# Altium project copper_suicide.PrjPCB (part 2 of 2)

## Sheet config-bank8.SchDoc: Config FPGA - Bank 8
size Letter; CompanyName: Brinton Engineering, LLC; Address1: 3479 Edison Way; Address2: Menlo Park CA 94025; Address3: +1 (877) 778-8435; Address4: brintonengineering.com; Revision: 1; SheetNumber: 1; SheetTotal: 1
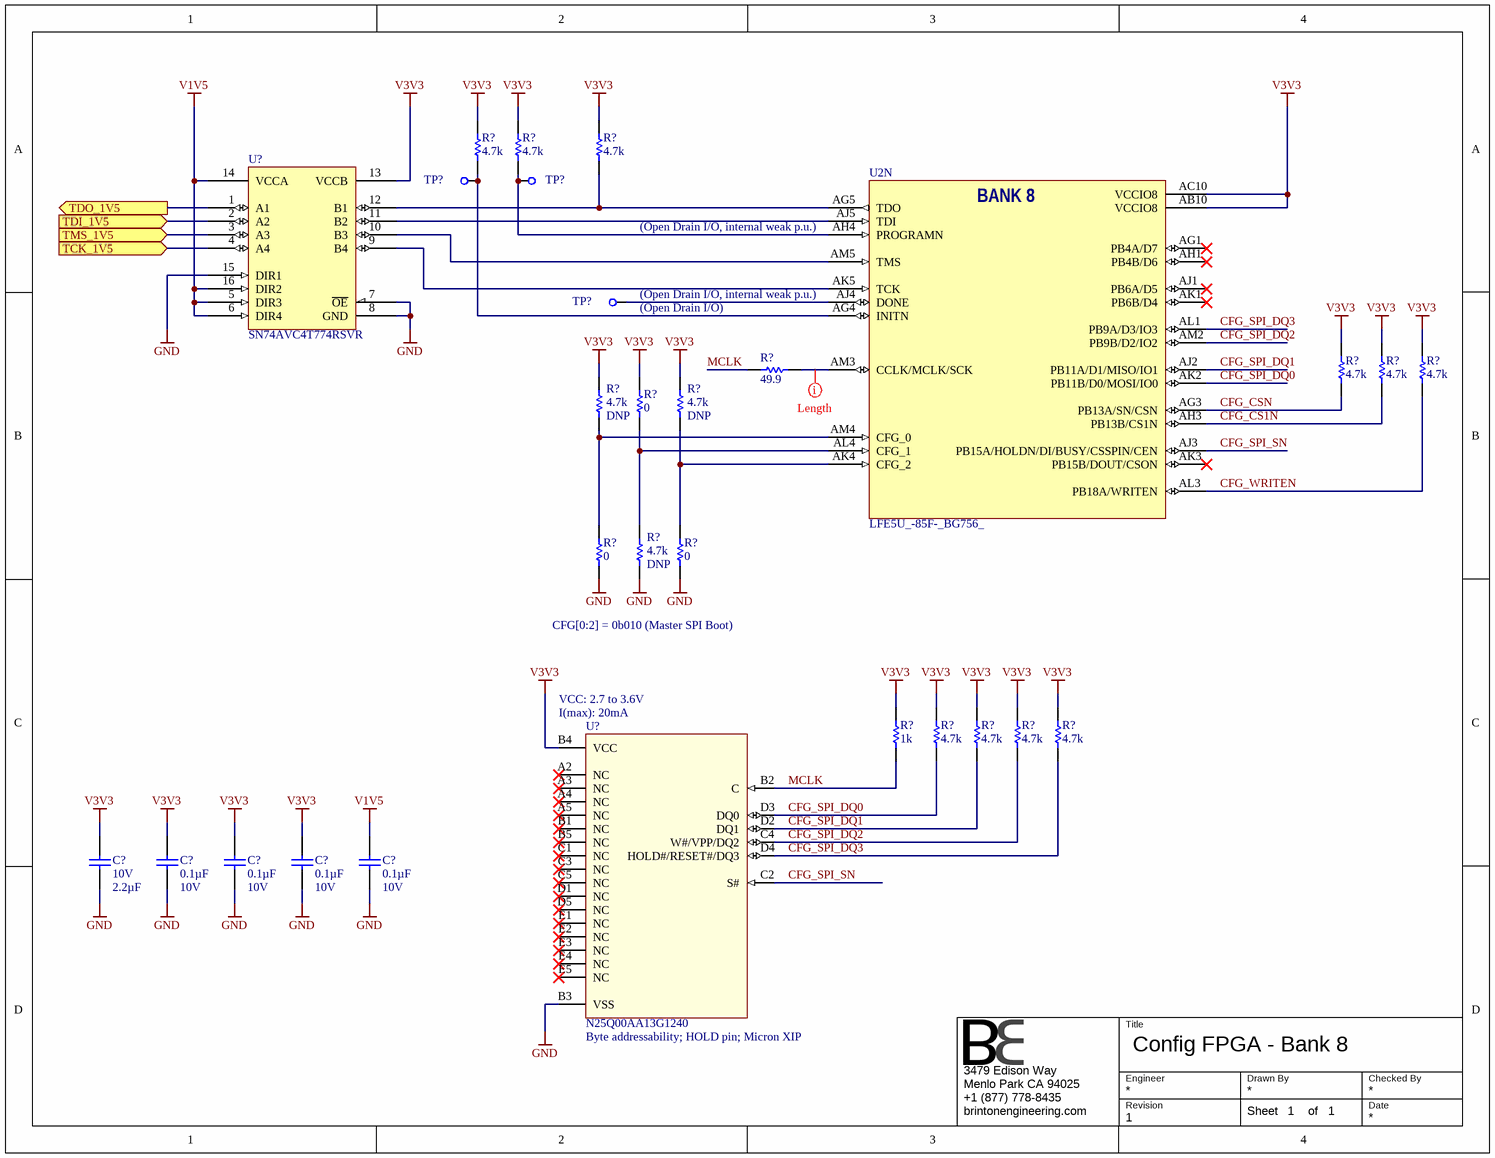
[diagram p16: config-bank8.SchDoc]

### Parts
(Parts that share a designator on the sheet are numbered #1, #2 ... from top to bottom, then left to right.)
C?#36  Voltage - Rated: 10V  Capacitance: 2.2µF  [CAPC1608X90N]  (hidden comment: GRM188R71A225KE15D)
C?#37  Capacitance: 0.1µF  Voltage - Rated: 10V  [CAPC1005X56N]  (hidden comment: GRM155R71A104KA01J)
C?#38  Capacitance: 0.1µF  Voltage - Rated: 10V  [CAPC1005X56N]  (hidden comment: GRM155R71A104KA01J)
C?#39  Capacitance: 0.1µF  Voltage - Rated: 10V  [CAPC1005X56N]  (hidden comment: GRM155R71A104KA01J)
C?#40  Capacitance: 0.1µF  Voltage - Rated: 10V  [CAPC1005X56N]  (hidden comment: GRM155R71A104KA01J)
R?#17  value 4.7k  [0603]  (hidden comment: RES 0603 4.7k 1%)
R?#18  value 4.7k  [0603]  (hidden comment: RES 0603 4.7k 1%)
R?#19  value 4.7k  [0603]  (hidden comment: RES 0603 4.7k 1%)
R?#20  value 49.9  [0603]  (hidden comment: RES 0603 49.9 1%)
R?#21  value 4.7k  [0603]  (hidden comment: RES 0603 4.7k 1%)
R?#22  value 4.7k  [0603]  (hidden comment: RES 0603 4.7k 1%)
R?#23  value 4.7k  [0603]  (hidden comment: RES 0603 4.7k 1%)
R?#24  value 4.7k  Do Not Place: DNP  [0603]  (hidden comment: RES 0603 4.7k 1%)
R?#25  value 0  [0603]  (hidden comment: RES 0603 0)
R?#26  value 4.7k  Do Not Place: DNP  [0603]  (hidden comment: RES 0603 4.7k 1%)
R?#27  value 0  [0603]  (hidden comment: RES 0603 0)
R?#28  value 4.7k  Do Not Place: DNP  [0603]  (hidden comment: RES 0603 4.7k 1%)
R?#29  value 0  [0603]  (hidden comment: RES 0603 0)
R?#30  value 1k  [0603]  (hidden comment: RES 0603 1k 1%)
R?#31  value 4.7k  [0603]  (hidden comment: RES 0603 4.7k 1%)
R?#32  value 4.7k  [0603]  (hidden comment: RES 0603 4.7k 1%)
R?#33  value 4.7k  [0603]  (hidden comment: RES 0603 4.7k 1%)
R?#34  value 4.7k  [0603]  (hidden comment: RES 0603 4.7k 1%)
TP?#2  TEST_POINT_SMD_10  [TEST_POINT_SMD_10]  (value not drawn)  (no BOM)
TP?#3  TEST_POINT_SMD_10  [TEST_POINT_SMD_10]  (value not drawn)  (no BOM)
TP?#4  TEST_POINT_SMD_10  [TEST_POINT_SMD_10]  (value not drawn)  (no BOM)
U2  LFE5U_-85F-_BG756_  [caBGA756]  (part N of 19)
U?#2  SN74AVC4T774RSVR  [RSV]
U?#3  N25Q00AA13G1240  [L-PBGA-24]

### Ports
TCK_1V5 (in), TDI_1V5 (in), TDO_1V5 (out), TMS_1V5 (in)

### Nets
GND: C?#36.1 C?#37.1 C?#38.1 C?#39.1 C?#40.1 R?#27.1 R?#28.1 R?#29.1 U?#2.7(~{OE}) U?#2.8(GND) U?#2.15(DIR1) U?#3.B3(VSS)
V1V5: C?#40.2 U?#2.5(DIR3) U?#2.6(DIR4) U?#2.14(VCCA) U?#2.16(DIR2)
V3V3: C?#36.2 C?#37.2 C?#38.2 C?#39.2 R?#17.2 R?#18.2 R?#19.2 R?#21.2 R?#22.2 R?#23.2 R?#24.2 R?#25.2 R?#26.2 R?#30.2 R?#31.2 R?#32.2 R?#33.2 R?#34.2 U2.AB10(VCCIO8) U2.AC10(VCCIO8) U?#2.13(VCCB) U?#3.B4(VCC)
CFG_CS1N: R?#22.1 U2.AH3(PB13B/CS1N)
CFG_CSN: R?#21.1 U2.AG3(PB13A/SN/CSN)
CFG_SPI_DQ0: R?#31.1 U2.AK2(PB11B/D0/MOSI/IO0) U?#3.D3(DQ0)
CFG_SPI_DQ1: R?#32.1 U2.AJ2(PB11A/D1/MISO/IO1) U?#3.D2(DQ1)
CFG_SPI_DQ2: R?#33.1 U2.AM2(PB9B/D2/IO2) U?#3.C4(W#/VPP/DQ2)
CFG_SPI_DQ3: R?#34.1 U2.AL1(PB9A/D3/IO3) U?#3.D4(HOLD#/RESET#/DQ3)
CFG_SPI_SN: U2.AJ3(PB15A/HOLDN/DI/BUSY/CSSPIN/CEN) U?#3.C2(S#)
CFG_WRITEN: R?#23.1 U2.AL3(PB18A/WRITEN)
MCLK: R?#20.2 R?#30.1 U?#3.B2(C)
NetR?#17_1: R?#17.1 TP?#2.1 U2.AG4(INITN)
NetR?#18_1: R?#18.1 TP?#3.1 U2.AH4(PROGRAMN)
NetR?#19_1: R?#19.1 U2.AG5(TDO) U?#2.12(B1)
NetR?#20_1: R?#20.1 U2.AM3(CCLK/MCLK/SCK)
NetR?#24_1: R?#24.1 R?#27.2 U2.AM4(CFG_0)
NetR?#25_1: R?#25.1 R?#28.2 U2.AL4(CFG_1)
NetR?#26_1: R?#26.1 R?#29.2 U2.AK4(CFG_2)
NetTP?#4_1: TP?#4.1 U2.AJ4(DONE)
NetU2_AJ5: U2.AJ5(TDI) U?#2.11(B2)
NetU2_AK5: U2.AK5(TCK) U?#2.9(B4)
NetU2_AM5: U2.AM5(TMS) U?#2.10(B3)
NetU?#2_1: U?#2.1(A1) ; port TDO_1V5
NetU?#2_2: U?#2.2(A2) ; port TDI_1V5
NetU?#2_3: U?#2.3(A3) ; port TMS_1V5
NetU?#2_4: U?#2.4(A4) ; port TCK_1V5

Not connected (* = marked no-connect by the designer): U2 AG1(PB4A/D7)* AH1(PB4B/D6)* AJ1(PB6A/D5)* AK1(PB6B/D4)* AK3(PB15B/DOUT/CSON)*; U?#3 A2(NC)* A3(NC)* A4(NC)* A5(NC)* B1(NC)* B5(NC)* C1(NC)* C3(NC)* C5(NC)* D1(NC)* D5(NC)* E1(NC)* E2(NC)* E3(NC)* E4(NC)* E5(NC)*

### Layout directives
rule Length Constraint [Min Length = 0mil    Max Length = 2000mil]: NetR?#20_1

### Notes on the sheet
- (near U2) (Open Drain I/O, internal weak p.u.)
- (near TP?#4) (Open Drain I/O)
- CFG[0:2] = 0b010 (Master SPI Boot)
- (near U?#3) VCC: 2.7 to 3.6V
- (near U?#3) I(max): 20mA
- (near U?#3) Byte addressability; HOLD pin; Micron XIP
- Title
- Engineer
- Revision
- Drawn By
- Checked By
- Date
- Sheet
- of
- (in symbol LFE5U_-85F-_BG756_, part N) BANK 8

### Library data of the parts
C?#36 = GRM188R71A225KE15D: CAP CER 2.2UF 10V 10% X7R 0603; Manufacturer: Murata Electronics North America; Manufacturer P/N: GRM188R71A225KE15D; Operating Temperature: -55°C ~ 125°C; Thickness (Max): 0.035" (0.90mm); Tolerance: ±10%; Package / Case: 0603 (1608 Metric); Temperature Coefficient: X7R; Supplier 1: Newark; Supplier 2: Digi-Key; RoHS: RoHS Compliant; Size / Dimension: 0.063" L x 0.031" W (1.60mm x 0.80mm); Mounting Type: Surface Mount, MLCC; ComponentLink1URL: http://www.murata.com/~/media/webrenewal/support/library/catalog/products/capacitor/mlcc/c02e.ashx; ComponentLink1Description: http://www.murata.com/~/media/webrenewal/support/library/catalog/products/capacitor/mlcc/c02e.ashx; Supplier Part Number 1: 72R4209; Supplier Part Number 2: 490-4520-1-ND
C?#37-C?#40 = GRM155R71A104KA01J: CAP CER 0.1UF 10V 10% X7R 0402; Manufacturer: Murata Electronics North America; Manufacturer P/N: GRM155R71A104KA01J; Operating Temperature: -55°C ~ 125°C; Thickness (Max): 0.022" (0.55mm); Size / Dimension: 0.039" L x 0.020" W (1.00mm x 0.50mm); RoHS: RoHS Compliant; Mounting Type: Surface Mount, MLCC; Supplier 1: Digi-Key; ComponentLink1URL: http://www.murata.com/~/media/webrenewal/support/library/catalog/products/capacitor/mlcc/c02e.ashx; ComponentLink1Description: http://www.murata.com/~/media/webrenewal/support/library/catalog/products/capacitor/mlcc/c02e.ashx; Supplier Part Number 1: 490-6322-1-ND; Temperature Coefficient: X7R; Package / Case: 0402 (1005 Metric); Tolerance: ±10%
R?#17-R?#19 R?#21-R?#24 R?#26 R?#28 R?#31-R?#34 = RES 0603 10k 1%: Thick Film Resistor 4.7k Ohms +/-1% 0.1W 75V SMD 0603; Manufacturer: Panasonic - ECG; Manufacturer P/N: ERJ3EKF4701V; Tcr: +/-100; Tr: -55:+155; Tolerance: +/-1%; Alternatives: *; Voltage: 75V; Power: 0.1W; P/N: ERJ3EKF4701V
R?#20 = RES 0603 10k 1%: Thick Film Resistor 49.9 Ohms +/-1% 0.1W 75V SMD 0603; Manufacturer: Panasonic - ECG; Manufacturer P/N: ERJ-3EKF49R9V; Tcr: +/-100; Tr: -55:+155; Tolerance: +/-1%; Alternatives: *; Voltage: 75V; Power: 0.1W; P/N: ERJ-3EKF49R9V
R?#25 R?#27 R?#29 = RES 0603 10k 1%: Thick Film Resistor 0 Ohms SMD 0603; Manufacturer: Panasonic - ECG; Manufacturer P/N: ERJ-3GEY0R00V; Tcr: +/-100; Tolerance: +/-1%; Tr: -55:+155; Voltage: 75V; Power: 0.1W; Alternatives: *; P/N: ERJ-3GEY0R00V
R?#30 = RES 0603 10k 1%: Thick Film Resistor 1k Ohms +/-1% 0.1W 75V SMD 0603; Manufacturer: Panasonic - ECG; Manufacturer P/N: ERJ3EKF1001V; Tcr: +/-100; Tr: -55:+155; Tolerance: +/-1%; Alternatives: *; Voltage: 75V; Power: 0.1W; P/N: ERJ3EKF1001V
TP?#2-TP?#4 = TEST_POINT_SMD_10: Test Point SMD
U2 = LFE5U_-85F-_BG756_: as U1 on sheet fpga-bank6; Manufacturer P/N: LFE5U_-85F-_BG756_
U?#2 = SN74AVC4T774RSVR: 4-Bit Dual-Supply Bus Transceiver; Manufacturer: Texas Instruments; Manufacturer P/N: SN74AVC4T774RSVR
U?#3 = N25Q00AA13G1240: 1024Mb, 3.3V Serial Flash Memory LBGA24; Manufacturer: Micron; Manufacturer P/N: N25Q00AA13G1240; Temperature: -40:85

## Sheet config-misc.SchDoc: Config FPGA - Misc
size Letter; CompanyName: Brinton Engineering, LLC; DrawnBy: FPGA - Misc; Address1: 3479 Edison Way; Address2: Menlo Park CA 94025; Address3: +1 (877) 778-8435; Address4: brintonengineering.com; Revision: 1; SheetNumber: 1; SheetTotal: 1
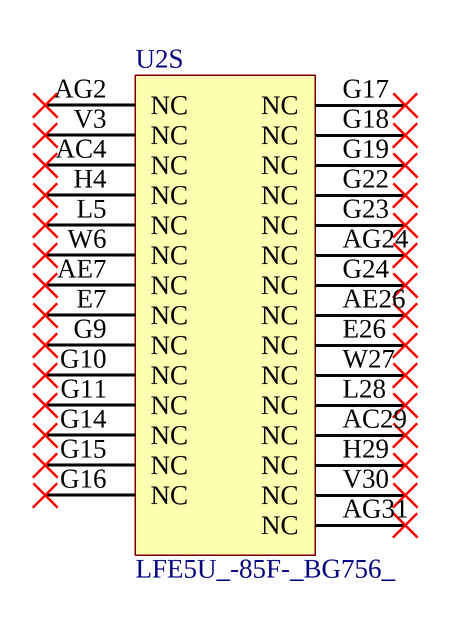
[diagram p17: config-misc.SchDoc]

### Parts
U2  LFE5U_-85F-_BG756_  [caBGA756]  (part S of 19)

### Nets

Not connected (* = marked no-connect by the designer): U2 AC4(NC)* AC29(NC)* AE7(NC)* AE26(NC)* AG2(NC)* AG24(NC)* AG31(NC)* E7(NC)* E26(NC)* G9(NC)* G10(NC)* G11(NC)* G14(NC)* G15(NC)* G16(NC)* G17(NC)* G18(NC)* G19(NC)* G22(NC)* G23(NC)* G24(NC)* H4(NC)* H29(NC)* L5(NC)* L28(NC)* V3(NC)* V30(NC)* W6(NC)* W27(NC)*

### Notes on the sheet
- Title
- Engineer
- Revision
- Drawn By
- Checked By
- Date
- Sheet
- of

### Library data of the parts
U2 = LFE5U_-85F-_BG756_: as U1 on sheet fpga-bank6; Manufacturer P/N: LFE5U_-85F-_BG756_

## Sheet config-ground.SchDoc: Config FPGA - Ground
size Letter; CompanyName: Brinton Engineering, LLC; Address1: 3479 Edison Way; Address2: Menlo Park CA 94025; Address3: +1 (877) 778-8435; Address4: brintonengineering.com; Revision: 1; SheetNumber: 1; SheetTotal: 1
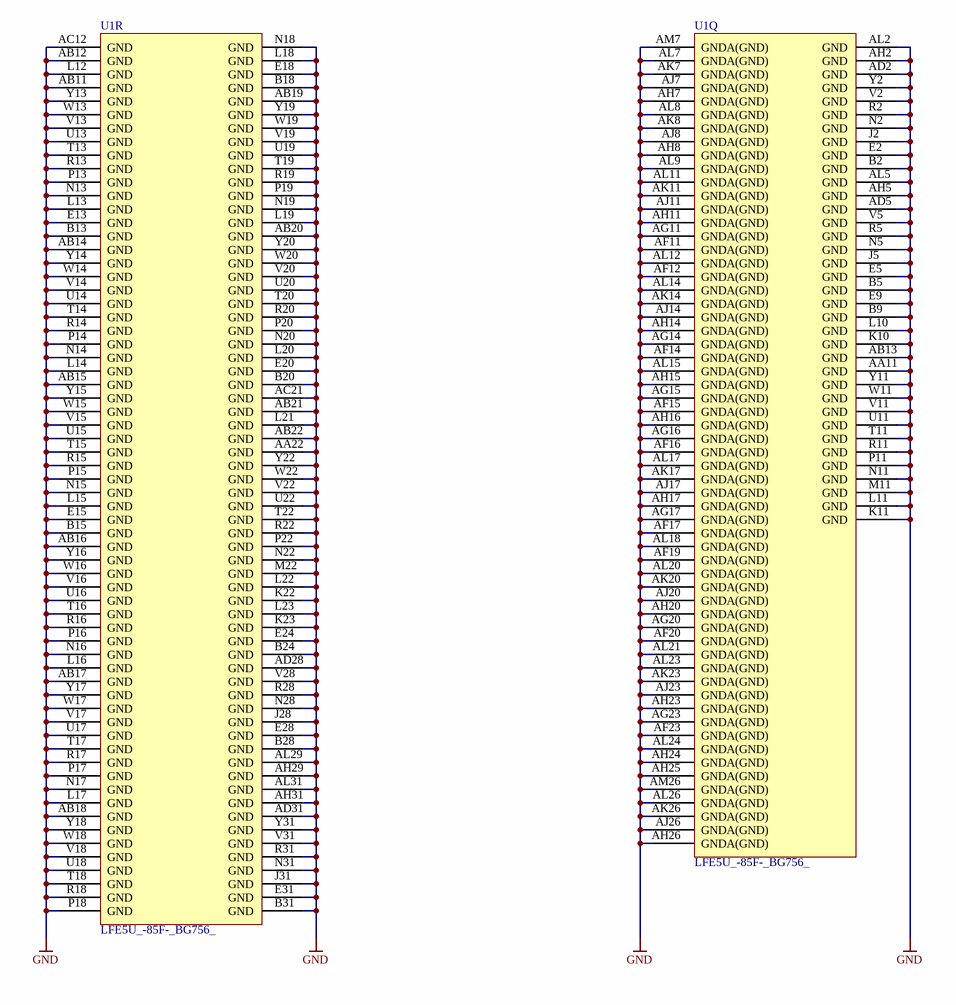
[diagram p18: config-ground.SchDoc]

### Parts
U1  LFE5U_-85F-_BG756_  [caBGA756]  (parts Q,R of 19)

### Nets
GND: U1.AA11(GND) U1.AA22(GND) U1.AB11(GND) U1.AB12(GND) U1.AB13(GND) U1.AB14(GND) U1.AB15(GND) U1.AB16(GND) U1.AB17(GND) U1.AB18(GND) U1.AB19(GND) U1.AB20(GND) U1.AB21(GND) U1.AB22(GND) U1.AC12(GND) U1.AC21(GND) U1.AD2(GND) U1.AD5(GND) U1.AD28(GND) U1.AD31(GND) U1.AF11(GNDA(GND)) U1.AF12(GNDA(GND)) U1.AF14(GNDA(GND)) U1.AF15(GNDA(GND)) U1.AF16(GNDA(GND)) U1.AF17(GNDA(GND)) U1.AF19(GNDA(GND)) U1.AF20(GNDA(GND)) U1.AF23(GNDA(GND)) U1.AG11(GNDA(GND)) U1.AG14(GNDA(GND)) U1.AG15(GNDA(GND)) U1.AG16(GNDA(GND)) U1.AG17(GNDA(GND)) U1.AG20(GNDA(GND)) U1.AG23(GNDA(GND)) U1.AH2(GND) U1.AH5(GND) U1.AH7(GNDA(GND)) U1.AH8(GNDA(GND)) U1.AH11(GNDA(GND)) U1.AH14(GNDA(GND)) U1.AH15(GNDA(GND)) U1.AH16(GNDA(GND)) U1.AH17(GNDA(GND)) U1.AH20(GNDA(GND)) U1.AH23(GNDA(GND)) U1.AH24(GNDA(GND)) U1.AH25(GNDA(GND)) U1.AH26(GNDA(GND)) U1.AH29(GND) U1.AH31(GND) U1.AJ7(GNDA(GND)) U1.AJ8(GNDA(GND)) U1.AJ11(GNDA(GND)) U1.AJ14(GNDA(GND)) U1.AJ17(GNDA(GND)) U1.AJ20(GNDA(GND)) U1.AJ23(GNDA(GND)) U1.AJ26(GNDA(GND)) U1.AK7(GNDA(GND)) U1.AK8(GNDA(GND)) U1.AK11(GNDA(GND)) U1.AK14(GNDA(GND)) U1.AK17(GNDA(GND)) U1.AK20(GNDA(GND)) U1.AK23(GNDA(GND)) U1.AK26(GNDA(GND)) U1.AL2(GND) U1.AL5(GND) U1.AL7(GNDA(GND)) U1.AL8(GNDA(GND)) U1.AL9(GNDA(GND)) U1.AL11(GNDA(GND)) U1.AL12(GNDA(GND)) U1.AL14(GNDA(GND)) U1.AL15(GNDA(GND)) U1.AL17(GNDA(GND)) U1.AL18(GNDA(GND)) U1.AL20(GNDA(GND)) U1.AL21(GNDA(GND)) U1.AL23(GNDA(GND)) U1.AL24(GNDA(GND)) U1.AL26(GNDA(GND)) U1.AL29(GND) U1.AL31(GND) U1.AM7(GNDA(GND)) U1.AM26(GNDA(GND)) U1.B2(GND) U1.B5(GND) U1.B9(GND) U1.B13(GND) U1.B15(GND) U1.B18(GND) U1.B20(GND) U1.B24(GND) U1.B28(GND) U1.B31(GND) U1.E2(GND) U1.E5(GND) U1.E9(GND) U1.E13(GND) U1.E15(GND) U1.E18(GND) U1.E20(GND) U1.E24(GND) U1.E28(GND) U1.E31(GND) U1.J2(GND) U1.J5(GND) U1.J28(GND) U1.J31(GND) U1.K10(GND) U1.K11(GND) U1.K22(GND) U1.K23(GND) U1.L10(GND) U1.L11(GND) U1.L12(GND) U1.L13(GND) U1.L14(GND) U1.L15(GND) U1.L16(GND) U1.L17(GND) U1.L18(GND) U1.L19(GND) U1.L20(GND) U1.L21(GND) U1.L22(GND) U1.L23(GND) U1.M11(GND) U1.M22(GND) U1.N2(GND) U1.N5(GND) U1.N11(GND) U1.N13(GND) U1.N14(GND) U1.N15(GND) U1.N16(GND) U1.N17(GND) U1.N18(GND) U1.N19(GND) U1.N20(GND) U1.N22(GND) U1.N28(GND) U1.N31(GND) U1.P11(GND) U1.P13(GND) U1.P14(GND) U1.P15(GND) U1.P16(GND) U1.P17(GND) U1.P18(GND) U1.P19(GND) U1.P20(GND) U1.P22(GND) U1.R2(GND) U1.R5(GND) U1.R11(GND) U1.R13(GND) U1.R14(GND) U1.R15(GND) U1.R16(GND) U1.R17(GND) U1.R18(GND) U1.R19(GND) U1.R20(GND) U1.R22(GND) U1.R28(GND) U1.R31(GND) U1.T11(GND) U1.T13(GND) U1.T14(GND) U1.T15(GND) U1.T16(GND) U1.T17(GND) U1.T18(GND) U1.T19(GND) U1.T20(GND) U1.T22(GND) U1.U11(GND) U1.U13(GND) U1.U14(GND) U1.U15(GND) U1.U16(GND) U1.U17(GND) U1.U18(GND) U1.U19(GND) U1.U20(GND) U1.U22(GND) U1.V2(GND) U1.V5(GND) U1.V11(GND) U1.V13(GND) U1.V14(GND) U1.V15(GND) U1.V16(GND) U1.V17(GND) U1.V18(GND) U1.V19(GND) U1.V20(GND) U1.V22(GND) U1.V28(GND) U1.V31(GND) U1.W11(GND) U1.W13(GND) U1.W14(GND) U1.W15(GND) U1.W16(GND) U1.W17(GND) U1.W18(GND) U1.W19(GND) U1.W20(GND) U1.W22(GND) U1.Y2(GND) U1.Y11(GND) U1.Y13(GND) U1.Y14(GND) U1.Y15(GND) U1.Y16(GND) U1.Y17(GND) U1.Y18(GND) U1.Y19(GND) U1.Y20(GND) U1.Y22(GND) U1.Y31(GND)

### Notes on the sheet
- Title
- Engineer
- Revision
- Drawn By
- Checked By
- Date
- Sheet
- of

### Library data of the parts
U1 = LFE5U_-85F-_BG756_: as U1 on sheet fpga-bank6; Manufacturer P/N: LFE5U_-85F-_BG756_

## Sheet config-power.SchDoc: Config FPGA - Power
size Letter; CompanyName: Brinton Engineering, LLC; Address1: 3479 Edison Way; Address2: Menlo Park CA 94025; Address3: +1 (877) 778-8435; Address4: brintonengineering.com; Revision: 1; SheetNumber: 1; SheetTotal: 1
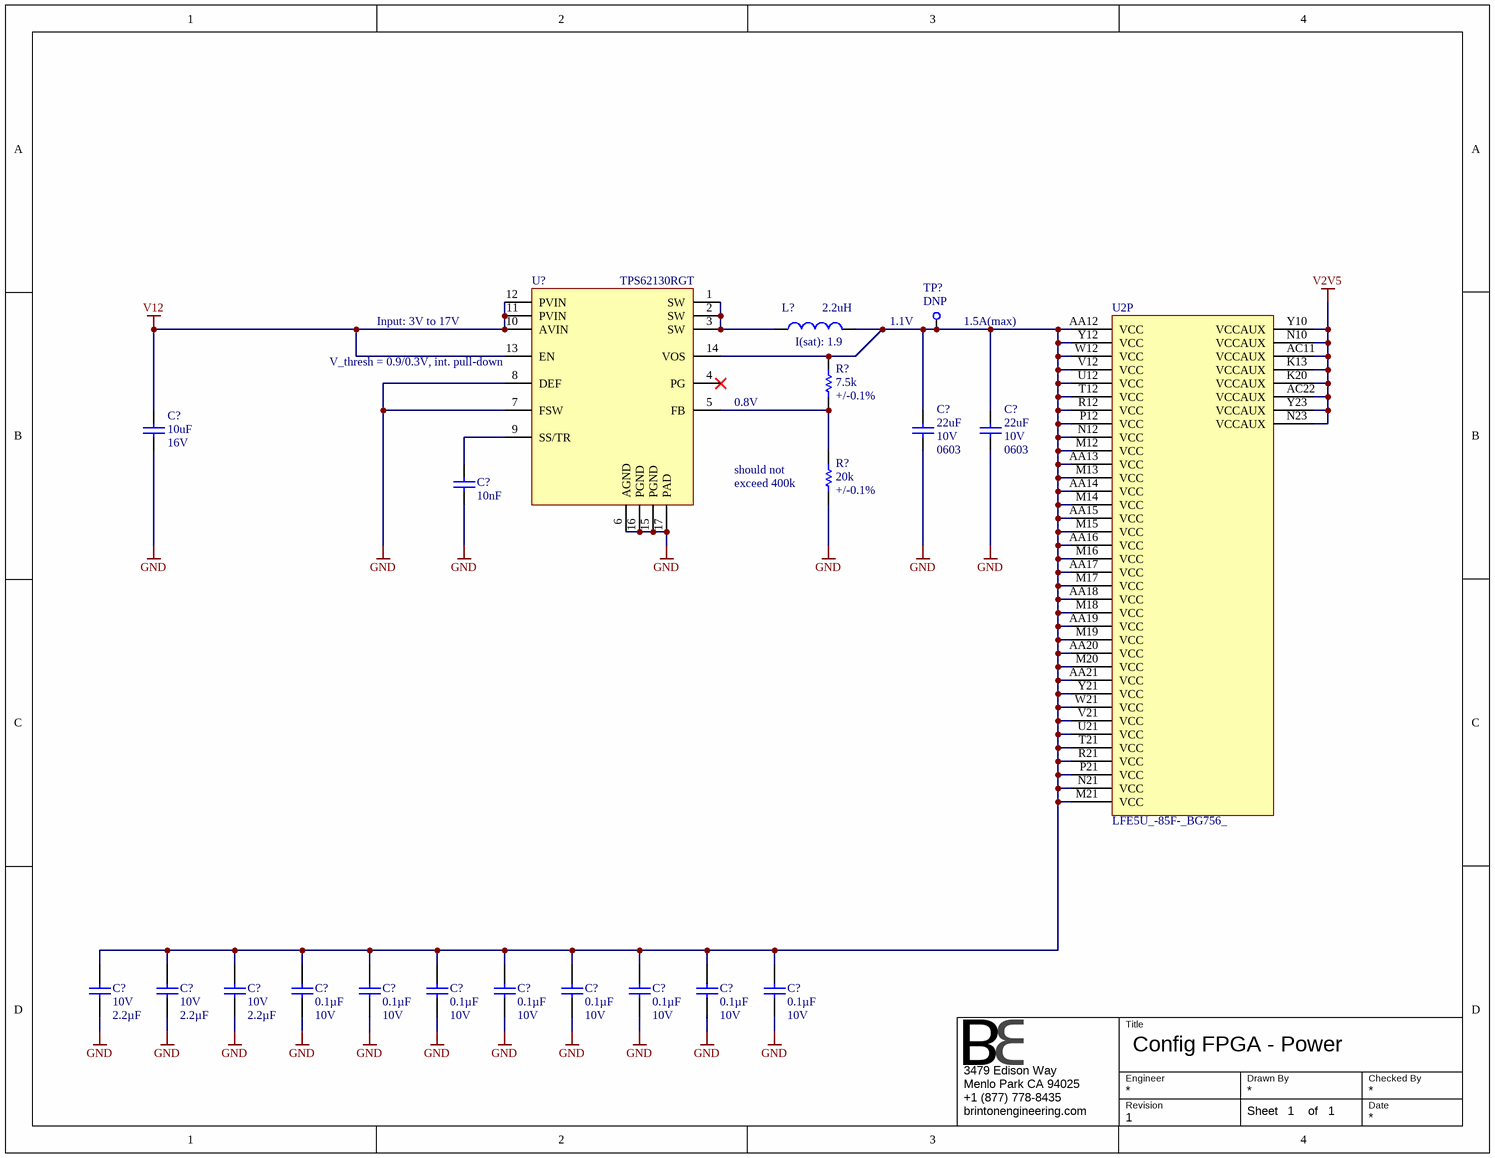
[diagram p19: config-power.SchDoc]

### Parts
(Parts that share a designator on the sheet are numbered #1, #2 ... from top to bottom, then left to right.)
C?#41  value 22uF  Voltage: 10V  [0603]  (hidden comment: C1608X5R1A226M080AC)
C?#42  value 22uF  Voltage: 10V  [0603]  (hidden comment: C1608X5R1A226M080AC)
C?#43  value 10uF  Voltage: 16V  [0603]  (hidden comment: CAP 10UF 0603)
C?#44  value 10nF  [0201]  (hidden comment: CAP 10NF 0201)
C?#45  Voltage - Rated: 10V  Capacitance: 2.2µF  [CAPC1608X90N]  (hidden comment: GRM188R71A225KE15D)
C?#46  Voltage - Rated: 10V  Capacitance: 2.2µF  [CAPC1608X90N]  (hidden comment: GRM188R71A225KE15D)
C?#47  Voltage - Rated: 10V  Capacitance: 2.2µF  [CAPC1608X90N]  (hidden comment: GRM188R71A225KE15D)
C?#48  Capacitance: 0.1µF  Voltage - Rated: 10V  [CAPC1005X56N]  (hidden comment: GRM155R71A104KA01J)
C?#49  Capacitance: 0.1µF  Voltage - Rated: 10V  [CAPC1005X56N]  (hidden comment: GRM155R71A104KA01J)
C?#50  Capacitance: 0.1µF  Voltage - Rated: 10V  [CAPC1005X56N]  (hidden comment: GRM155R71A104KA01J)
C?#51  Capacitance: 0.1µF  Voltage - Rated: 10V  [CAPC1005X56N]  (hidden comment: GRM155R71A104KA01J)
C?#52  Capacitance: 0.1µF  Voltage - Rated: 10V  [CAPC1005X56N]  (hidden comment: GRM155R71A104KA01J)
C?#53  Capacitance: 0.1µF  Voltage - Rated: 10V  [CAPC1005X56N]  (hidden comment: GRM155R71A104KA01J)
C?#54  Capacitance: 0.1µF  Voltage - Rated: 10V  [CAPC1005X56N]  (hidden comment: GRM155R71A104KA01J)
C?#55  Capacitance: 0.1µF  Voltage - Rated: 10V  [CAPC1005X56N]  (hidden comment: GRM155R71A104KA01J)
L?#2  value 2.2uH  I(sat): 1.9  [ASPI-3010FS]  (hidden comment: ASPI-0310FS-2R2M-T2)
R?#35  value 7.5k  Tolerance: +/-0.1%  [RESC1608X55N]  (hidden comment: RES 0603 7.5k 0.1%)
R?#36  value 20k  Tolerance: +/-0.1%  [RESC1608X55N]  (hidden comment: RES 0603 20k 0.1%)
TP?#5  Do Not Place: DNP  [TEST_POINT]  (hidden comment: TEST_POINT)
U2  LFE5U_-85F-_BG756_  [caBGA756]  (part P of 19)
U?#4  TPS62130RGT  [S-PQFP-8N]

### Nets
GND: C?#41.1 C?#42.1 C?#43.1 C?#44.2 C?#45.1 C?#46.1 C?#47.1 C?#48.1 C?#49.1 C?#50.1 C?#51.1 C?#52.1 C?#53.1 C?#54.1 C?#55.1 R?#36.1 U?#4.6(AGND) U?#4.7(FSW) U?#4.8(DEF) U?#4.15(PGND) U?#4.16(PGND) U?#4.17(PAD)
V2V5: U2.AC11(VCCAUX) U2.AC22(VCCAUX) U2.K13(VCCAUX) U2.K20(VCCAUX) U2.N10(VCCAUX) U2.N23(VCCAUX) U2.Y10(VCCAUX) U2.Y23(VCCAUX)
V12: C?#43.2 U?#4.10(AVIN) U?#4.11(PVIN) U?#4.12(PVIN) U?#4.13(EN)
NetC?#41_2: C?#41.2 C?#42.2 C?#45.2 C?#46.2 C?#47.2 C?#48.2 C?#49.2 C?#50.2 C?#51.2 C?#52.2 C?#53.2 C?#54.2 C?#55.2 L?#2.2 R?#35.2 TP?#5.1 U2.AA12(VCC) U2.AA13(VCC) U2.AA14(VCC) U2.AA15(VCC) U2.AA16(VCC) U2.AA17(VCC) U2.AA18(VCC) U2.AA19(VCC) U2.AA20(VCC) U2.AA21(VCC) U2.M12(VCC) U2.M13(VCC) U2.M14(VCC) U2.M15(VCC) U2.M16(VCC) U2.M17(VCC) U2.M18(VCC) U2.M19(VCC) U2.M20(VCC) U2.M21(VCC) U2.N12(VCC) U2.N21(VCC) U2.P12(VCC) U2.P21(VCC) U2.R12(VCC) U2.R21(VCC) U2.T12(VCC) U2.T21(VCC) U2.U12(VCC) U2.U21(VCC) U2.V12(VCC) U2.V21(VCC) U2.W12(VCC) U2.W21(VCC) U2.Y12(VCC) U2.Y21(VCC) U?#4.14(VOS)
NetC?#44_1: C?#44.1 U?#4.9(SS/TR)
NetL?#2_1: L?#2.1 U?#4.1(SW) U?#4.2(SW) U?#4.3(SW)
NetR?#35_1: R?#35.1 R?#36.2 U?#4.5(FB)

Not connected (* = marked no-connect by the designer): U?#4 4(PG)*

### Notes on the sheet
- (near U?#4) V_thresh = 0.9/0.3V, int. pull-down
- Input: 3V to 17V
- (near TP?#5) 1.1V
- (near TP?#5) 1.5A(max)
- (near U?#4) 0.8V
- should not
- exceed 400k
- Title
- Engineer
- Revision
- Drawn By
- Checked By
- Date
- Sheet
- of

### Library data of the parts
C?#41 C?#42 = CAP: Ceramic Capacitor 22uF +/-20% 10V X5R SMD 0603; Manufacturer: TDK Corporation; Tr: -55:85; Manufacturer P/N: C1608X5R1A226M080AC; Tolerance: +/-20%
C?#43 = CAP: Ceramic Capacitor 10uF +/-20% 16V X5R 0603; Manufacturer: Taiyo Yuden; Manufacturer P/N: EMK107BBJ106MA-T; Tolerance: *; Footprint: *; Tr: *; Distributor: Digi-Key; Distributor P/N: *
C?#44 = CAP: Ceramic Capacitor 10nF +/-10% 10V X5R 0201; Manufacturer: TDK Corporation; Manufacturer P/N: C0603X5R1A103K030BA; Tolerance: *; Voltage: 10V; Footprint: *; Tr: *; Distributor: Digi-Key; Distributor P/N: *
C?#45-C?#47 = GRM188R71A225KE15D: as C?#36 on sheet config-bank8; Manufacturer P/N: GRM188R71A225KE15D; Operating Temperature: -55°C ~ 125°C; Thickness (Max): 0.035" (0.90mm); Tolerance: ±10%; Package / Case: 0603 (1608 Metric); Temperature Coefficient: X7R; Supplier 1: Newark; Supplier 2: Digi-Key; RoHS: RoHS Compliant; Size / Dimension: 0.063" L x 0.031" W (1.60mm x 0.80mm); Mounting Type: Surface Mount, MLCC; ComponentLink1URL: http://www.murata.com/~/media/webrenewal/support/library/catalog/products/capacitor/mlcc/c02e.ashx; ComponentLink1Description: http://www.murata.com/~/media/webrenewal/support/library/catalog/products/capacitor/mlcc/c02e.ashx; Supplier Part Number 1: 72R4209; Supplier Part Number 2: 490-4520-1-ND
C?#48-C?#55 = GRM155R71A104KA01J: as C?#37 on sheet config-bank8; Manufacturer P/N: GRM155R71A104KA01J; Operating Temperature: -55°C ~ 125°C; Thickness (Max): 0.022" (0.55mm); Size / Dimension: 0.039" L x 0.020" W (1.00mm x 0.50mm); RoHS: RoHS Compliant; Mounting Type: Surface Mount, MLCC; Supplier 1: Digi-Key; ComponentLink1URL: http://www.murata.com/~/media/webrenewal/support/library/catalog/products/capacitor/mlcc/c02e.ashx; ComponentLink1Description: http://www.murata.com/~/media/webrenewal/support/library/catalog/products/capacitor/mlcc/c02e.ashx; Supplier Part Number 1: 490-6322-1-ND; Temperature Coefficient: X7R; Package / Case: 0402 (1005 Metric); Tolerance: ±10%
L?#2 = COIL: Wirewound Inductor 2.2uH +/-20% 1.9A SMD 2518; Manufacturer: Abracon; Manufacturer P/N: ASPI-0310FS-2R2M-T2
R?#35 = RES 0603 10k 1%: Thick Film Resistor 7.5k Ohms +/-0.1% 0.1W 75V SMD 0603; Manufacturer: Panasonic - ECG; Manufacturer P/N: ERA-3APB752V; Tcr: +/-15; Tr: -55:+125; Alternatives: *; Voltage: 75V; Power: 0.1W; Footprint: 0603; P/N: ERA-3APB752V
R?#36 = RES 0603 10k 1%: Thick Film Resistor 20k Ohms +/-0.1% 0.1W 75V SMD 0603; Manufacturer: Panasonic - ECG; Manufacturer P/N: ERA-3APB203V; Tcr: +/-15; Tr: -55:+125; Alternatives: *; Voltage: 75V; Power: 0.1W; Footprint: 0603; P/N: ERA-3APB203V
TP?#5 = TEST_POINT: Thruhole Miniature Test Point; Manufacturer P/N: 5000; Manufacturer: Keystone Electronics Corp
U2 = LFE5U_-85F-_BG756_: as U1 on sheet fpga-bank6; Manufacturer P/N: LFE5U_-85F-_BG756_
U?#4 = TPS62130RGT: 3-17V 3A Step-Down Converter VQFN; Manufacturer: Texas Instruments; Manufacturer P/N: TPS62130RGT

## Sheet config-serdes.SchDoc: Config FPGA - Serdes
size Letter; CompanyName: Brinton Engineering, LLC; Address1: 3479 Edison Way; Address2: Menlo Park CA 94025; Address3: +1 (877) 778-8435; Address4: brintonengineering.com; Revision: 1; SheetNumber: 1; SheetTotal: 1
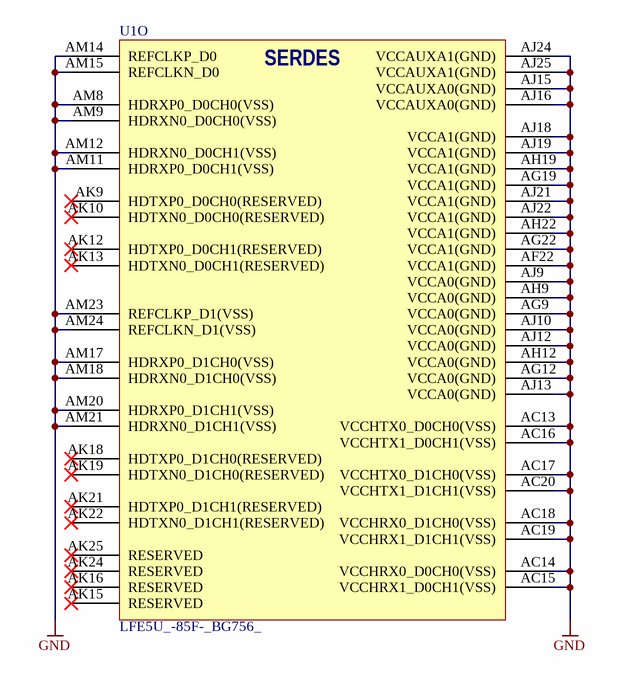
[diagram p20: config-serdes.SchDoc]

### Parts
U1  LFE5U_-85F-_BG756_  [caBGA756]  (part O of 19)

### Nets
GND: U1.AC13(VCCHTX0_D0CH0(VSS)) U1.AC14(VCCHRX0_D0CH0(VSS)) U1.AC15(VCCHRX1_D0CH1(VSS)) U1.AC16(VCCHTX1_D0CH1(VSS)) U1.AC17(VCCHTX0_D1CH0(VSS)) U1.AC18(VCCHRX0_D1CH0(VSS)) U1.AC19(VCCHRX1_D1CH1(VSS)) U1.AC20(VCCHTX1_D1CH1(VSS)) U1.AF22(VCCA1(GND)) U1.AG9(VCCA0(GND)) U1.AG12(VCCA0(GND)) U1.AG19(VCCA1(GND)) U1.AG22(VCCA1(GND)) U1.AH9(VCCA0(GND)) U1.AH12(VCCA0(GND)) U1.AH19(VCCA1(GND)) U1.AH22(VCCA1(GND)) U1.AJ9(VCCA0(GND)) U1.AJ10(VCCA0(GND)) U1.AJ12(VCCA0(GND)) U1.AJ13(VCCA0(GND)) U1.AJ15(VCCAUXA0(GND)) U1.AJ16(VCCAUXA0(GND)) U1.AJ18(VCCA1(GND)) U1.AJ19(VCCA1(GND)) U1.AJ21(VCCA1(GND)) U1.AJ22(VCCA1(GND)) U1.AJ24(VCCAUXA1(GND)) U1.AJ25(VCCAUXA1(GND)) U1.AM8(HDRXP0_D0CH0(VSS)) U1.AM9(HDRXN0_D0CH0(VSS)) U1.AM11(HDRXP0_D0CH1(VSS)) U1.AM12(HDRXN0_D0CH1(VSS)) U1.AM14(REFCLKP_D0) U1.AM15(REFCLKN_D0) U1.AM17(HDRXP0_D1CH0(VSS)) U1.AM18(HDRXN0_D1CH0(VSS)) U1.AM20(HDRXP0_D1CH1(VSS)) U1.AM21(HDRXN0_D1CH1(VSS)) U1.AM23(REFCLKP_D1(VSS)) U1.AM24(REFCLKN_D1(VSS))

Not connected (* = marked no-connect by the designer): U1 AK9(HDTXP0_D0CH0(RESERVED))* AK10(HDTXN0_D0CH0(RESERVED))* AK12(HDTXP0_D0CH1(RESERVED))* AK13(HDTXN0_D0CH1(RESERVED))* AK15(RESERVED)* AK16(RESERVED)* AK18(HDTXP0_D1CH0(RESERVED))* AK19(HDTXN0_D1CH0(RESERVED))* AK21(HDTXP0_D1CH1(RESERVED))* AK22(HDTXN0_D1CH1(RESERVED))* AK24(RESERVED)* AK25(RESERVED)*

### Notes on the sheet
- Title
- Engineer
- Revision
- Drawn By
- Checked By
- Date
- Sheet
- of
- (in symbol LFE5U_-85F-_BG756_, part O) SERDES

### Library data of the parts
U1 = LFE5U_-85F-_BG756_: ECP5 FPGA, 85k LUT, 756-caBGA; Manufacturer: Lattice Semiconductor; Manufacturer P/N: LFE5U_-85F-_BG756_

## Sheet history0.SchDoc
size Letter; CompanyName: Brinton Engineering, LLC; Address1: 3479 Edison Way; Address2: Menlo Park CA 94025; Address3: +1 (877) 778-8435; Address4: brintonengineering.com; Revision: 1; SheetNumber: 1; SheetTotal: 1

### Notes on the sheet
- Title
- Engineer
- Revision
- Drawn By
- Checked By
- Date
- Sheet
- of

## Sheet power-v2v5.SchDoc
size Letter; CompanyName: Brinton Engineering, LLC; Address1: 3479 Edison Way; Address2: Menlo Park CA 94025; Address3: +1 (877) 778-8435; Address4: brintonengineering.com; Revision: 1; SheetNumber: 1; SheetTotal: 1

### Notes on the sheet
- Title
- Engineer
- Revision
- Drawn By
- Checked By
- Date
- Sheet
- of

## Sheet power-v1v5.SchDoc
size Letter; CompanyName: Brinton Engineering, LLC; Address1: 3479 Edison Way; Address2: Menlo Park CA 94025; Address3: +1 (877) 778-8435; Address4: brintonengineering.com; Revision: 1; SheetNumber: 1; SheetTotal: 1

### Notes on the sheet
- Title
- Engineer
- Revision
- Drawn By
- Checked By
- Date
- Sheet
- of

## Nets that join several sheets
GND: fpga-bank6 (7 pins), fpga-bank8 (9 pins), fpga-power (22 pins), config-bank0 (U2.K12 U2.K14 U2.K15 U2.K16), config-bank1 (U2.K17 U2.K18 U2.K19 U2.K21), config-bank3 (U2.AA23 U2.U23 U2.V23 U2.W23), config-bank4 (U1.AB23 U1.AC23), config-bank6 (U2.AA10 U2.U10 U2.V10 U2.W10), config-bank7 (5 pins), config-bank2 (5 pins), config-bank8 (12 pins), config-ground (226 pins), config-power (22 pins), config-serdes (41 pins)
V1V5: fpga-bank6 (9 pins), fpga-bank8 (7 pins), config-bank7 (9 pins), config-bank2 (9 pins), config-bank8 (5 pins)
V2V5: fpga-power (8 pins), config-power (8 pins)
V3V3: fpga-bank8 (8 pins), config-bank8 (22 pins)
V12: fpga-power (5 pins), config-power (5 pins)